# Altium schematic sheet 06_nRF_POWER_SWD_RF.SchDoc: SENSEI Base Board - nRF Power
size A3; DrawnBy: Sebastian Frey; Organization: Integrated Systems Laboratory; DocumentNumber: 7; Revision: v1.0; SheetNumber: 7; SheetTotal: 12
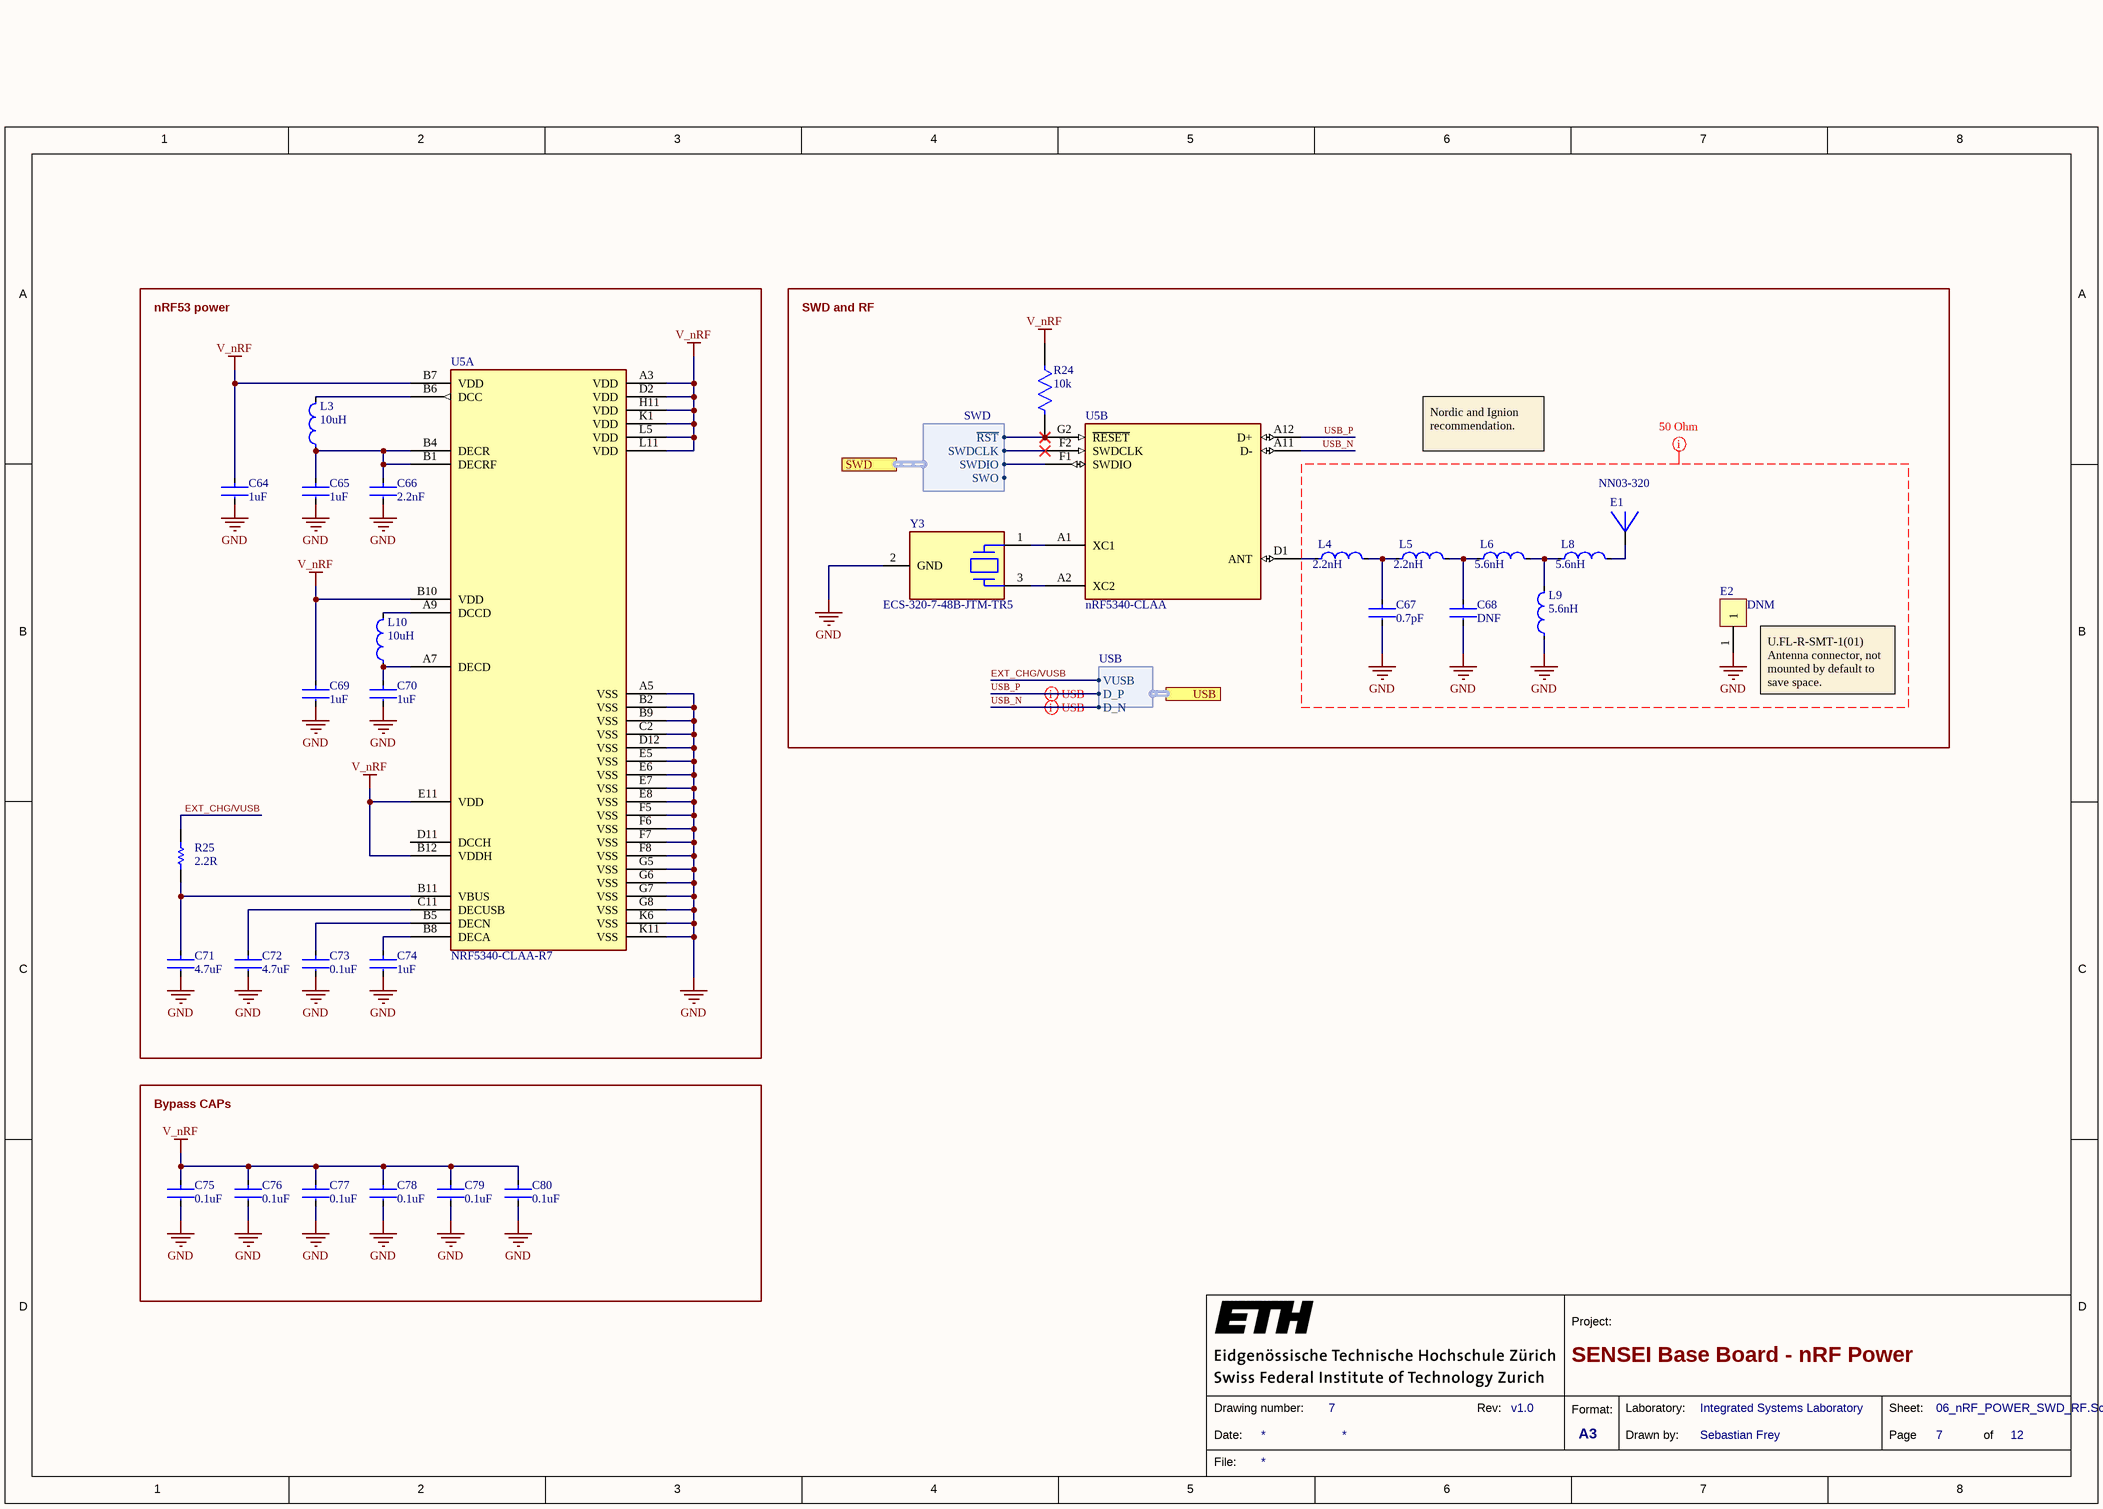
[diagram p0: 06_nRF_POWER_SWD_RF.SchDoc]

## Parts
C64  Capacitance: 1uF  [FP-CL03-IPC_B]  (hidden comment: CL03A105KP3NSNC)
C65  Capacitance: 1uF  [FP-CL03-IPC_B]  (hidden comment: CL03A105KP3NSNC)
C66  Capacitance: 2.2nF  [FP-GRM033-0_03-MFG]  (hidden comment: GRM033R71C222KA88D)
C67  Capacitance: 0.7pF  [FP-GJM033-0_03-IPC_C]  (hidden comment: GJM0335C1ER70BB01D)
C68  DNF  [FP-GRM033-0_03-MFG]
C69  Capacitance: 1uF  [FP-CL03-IPC_B]  (hidden comment: CL03A105KP3NSNC)
C70  Capacitance: 1uF  [FP-CL03-IPC_B]  (hidden comment: CL03A105KP3NSNC)
C71  Capacitance: 4.7uF  [FP-C1005-050-0_15-IPC_B]  (hidden comment: C1005X5R0J475K050BC)
C72  Capacitance: 4.7uF  [FP-C1005-050-0_15-IPC_B]  (hidden comment: C1005X5R0J475K050BC)
C73  Capacitance: 0.1uF  [FP-GRM033-0_03-IPC_B]  (hidden comment: GRM033Z71C104KE14D)
C74  Capacitance: 1uF  [FP-CL03-IPC_B]  (hidden comment: CL03A105KP3NSNC)
C75  Capacitance: 0.1uF  [FP-GRM033-0_03-IPC_B]  (hidden comment: GRM033Z71C104KE14D)
C76  Capacitance: 0.1uF  [FP-GRM033-0_03-IPC_B]  (hidden comment: GRM033Z71C104KE14D)
C77  Capacitance: 0.1uF  [FP-GRM033-0_03-IPC_B]  (hidden comment: GRM033Z71C104KE14D)
C78  Capacitance: 0.1uF  [FP-GRM033-0_03-IPC_B]  (hidden comment: GRM033Z71C104KE14D)
C79  Capacitance: 0.1uF  [FP-GRM033-0_03-IPC_B]  (hidden comment: GRM033Z71C104KE14D)
C80  Capacitance: 0.1uF  [FP-GRM033-0_03-IPC_B]  (hidden comment: GRM033Z71C104KE14D)
E1  NN03-320  [NN03-320]
E2  DNM  [U.FL-R-SMT-1(01)_GND_pad_small]
L3  Parameter 1: 10uH  [FP-LQM18DN_70-IPC_C]  (hidden comment: LQM18DN100M70L)
L4  Inductance: 2.2nH  [FP-LQP03HQ_02-MFG]  (hidden comment: LQP03HQ2N2B02D)
L5  Inductance: 2.2nH  [FP-LQP03HQ_02-MFG]  (hidden comment: LQP03HQ2N2B02D)
L6  Inductance: 5.6nH  [FP-LQW03AW_00-MFG]  (hidden comment: LQW03AW5N6J00D)
L8  Inductance: 5.6nH  [FP-LQW03AW_00-MFG]  (hidden comment: LQW03AW5N6J00D)
L9  Inductance: 5.6nH  [FP-LQW03AW_00-MFG]  (hidden comment: LQW03AW5N6J00D)
L10  Parameter 1: 10uH  [FP-LQM18DN_70-IPC_C]  (hidden comment: LQM18DN100M70L)
R24  Resistance: 10k  [FP-RMCF0201-IPC_C]  (hidden comment: RMCF0201FT10K0)
R25  value 2.2R  [RESC0201(0603)_L]  (hidden comment: RC0201FR-072R2L)
U5  NRF5340-CLAA-R7  [NRF5340_WLCSP]  (parts A,B of 3)
Y3  ECS-320-7-48B-JTM-TR5  [Y_ECX-1048]

## Blocks framed on the sheet
nRF53 power: C64-C66 C69-C74 L3 L10 R25 U5
SWD and RF: C67 C68 E1 E2 L4-L6 L8 L9 R24 U5 Y3
Bypass CAPs: C75-C80

## Ports
SWD (harness SWD), USB (harness USB)

## Harnesses
SWD: ~{RST}, SWDIO, SWDCLK, SWO
USB: VUSB, D_P, D_N

## Nets
GND: C64.2 C65.2 C66.2 C67.2 C68.2 C69.2 C70.2 C71.2 C72.2 C73.2 C74.2 C75.2 C76.2 C77.2 C78.2 C79.2 C80.2 E2.1 L9.1 U5.A5(VSS) U5.B2(VSS) U5.B9(VSS) U5.C2(VSS) U5.D12(VSS) U5.E5(VSS) U5.E6(VSS) U5.E7(VSS) U5.E8(VSS) U5.F5(VSS) U5.F6(VSS) U5.F7(VSS) U5.F8(VSS) U5.G5(VSS) U5.G6(VSS) U5.G7(VSS) U5.G8(VSS) U5.K6(VSS) U5.K11(VSS) Y3.2(GND)
V_nRF: C64.1 C69.1 C75.1 C76.1 C77.1 C78.1 C79.1 C80.1 R24.1 U5.A3(VDD) U5.B7(VDD) U5.B10(VDD) U5.B12(VDDH) U5.D2(VDD) U5.E11(VDD) U5.H11(VDD) U5.K1(VDD) U5.L5(VDD) U5.L11(VDD)
EXT_CHG/VUSB: R25.2 ; port USB.VUSB
USB_N: U5.A11(D-) ; port USB.D_N
USB_P: U5.A12(D+) ; port USB.D_P
NetC65_1: C65.1 C66.1 L3.1 U5.B1(DECRF) U5.B4(DECR)
NetC67_1: C67.1 L4.2 L5.1
NetC68_1: C68.1 L5.2 L6.1
NetC70_1: C70.1 L10.1 U5.A7(DECD)
NetC71_1: C71.1 R25.1 U5.B11(VBUS)
NetC72_1: C72.1 U5.C11(DECUSB)
NetC73_1: C73.1 U5.B5(DECN)
NetC74_1: C74.1 U5.B8(DECA)
NetE1_1: E1.1 L8.2
NetL3_2: L3.2 U5.B6(DCC)
NetL4_1: L4.1 U5.D1(ANT)
NetL6_2: L6.2 L8.1 L9.2
NetL10_2: L10.2 U5.A9(DCCD)
NetR24_2: R24.2 U5.G2(~{RESET}) ; port SWD.~{RST}
NetU5_A1: U5.A1(XC1) Y3.1
NetU5_A2: U5.A2(XC2) Y3.3
NetU5_F1: U5.F1(SWDIO) ; port SWD.SWDIO
NetU5_F2: U5.F2(SWDCLK) ; port SWD.SWDCLK

Not connected (* = marked no-connect by the designer): U5 D11(DCCH)

## Layout directives
net class 50OHM: GND
differential pair: USB_N, USB_P

## Notes on the sheet
- Nordic and Ignion recommendation.
- (near E2) U.FL-R-SMT-1(01)
  Antenna connector, not mounted by default to save space.
- 1
- 2
- 3
- 4
- 5
- 6
- 7
- 8
- A
- B
- C
- D
- Project:
- Date:
- Drawing number:
- Rev:
- Format:
- A3
- Drawn by:
- Laboratory:
- Page
- Sheet:
- of
- File:

## Library data of the parts
C64 C65 C69 C70 C74 = CMP-13271-003594-1: Cap Ceramic 1uF 10V X5R ±10% Pad SMD 0201 +85°C T/R; Min Operating Temperature: -55°C; Mount: Surface Mount; Packaging: Cut Tape; Width: 0.012inch; Tolerance: 10%; Case Code (Imperial): 0201; Thickness: 0.013inch; Length: 0.024inch; Case/Package: 0201; Max Operating Temperature: 85°C; Voltage Rating: 10V; Case Code (Metric): 0603
C66 = CMP-2010-01694-2: Chip Multilayer Ceramic Capacitors for General Purpose, 0201, 2200pF, X7R, 15%, 10%, 16V; Depth: 0.3mm; Package Quantity: 1; Min Operating Temperature: -55°C; Mount: Surface Mount; Case/Package: 0201; Packaging: Tape and Reel; Case Code (Imperial): 0201; Material: Ceramic; Voltage Rating: 16V; Termination: SMD/SMT; Tolerance: 10%; Case Code (Metric): 0603; Height: 0.3mm; Length: 0.6mm; Voltage Rating (DC): 16V; Width: 0.012inch; Thickness: 0.013inch; Radiation Hardening: No; REACH SVHC: No SVHC; Lead Free: Lead Free; Voltage: 16V; Max Operating Temperature: 125°C; Dielectric: X7R
C67 = CMP-2010-00919-2: Ceramic Capacitor 0.7pF ±0.1pF 25V C0G 0201 (0603 Metric); Width: 0.012inch; Case Code (Metric): 0603; Min Operating Temperature: -55°C; Lead Free: Lead Free; Dielectric: C0G; Packaging: Tape and Reel; Thickness: 0.013inch; Mount: Surface Mount; Radiation Hardening: No; Height: 0.3mm; Voltage Rating (DC): 25V; Case Code (Imperial): 0201; Case/Package: 0201; Package Quantity: 15000; Max Operating Temperature: 125°C; Voltage Rating: 25V; Termination: SMD/SMT; Length: 0.6mm; Depth: 0.3mm
C68 = CMP-06035-035508-1: Case/Package: 0201; Capacitance: DNF
C71 C72 = CMP-2000-05437-2: CAP CER 4.7UF 6.3V X5R 0402 10%; Dielectric Material: Ceramic; Voltage: 6.3V; Depth: 0.5mm; Tolerance: 10%; Height: 0.5mm; Length: 1mm; Termination: SMD/SMT; RoHS Compliant: Yes; Series: C; Case/Package: 0402; Dielectric: X5R; Lead Free: Lead Free; Mount: Surface Mount; Max Operating Temperature: 85°C; Min Operating Temperature: -55°C
C73 C75-C80 = CMP-06035-035508-1: Chip Multilayer Ceramic Capacitors for General Purpose, 0201, 0.10uF, X7R, 15%, 10%, 16V; Case/Package: 0201
E1 = NN03-320: Integrated Chip Antenna; Manufacturer: Fractus Antennas; Supplier 1: Mouser; Manufacturer Part Number: NN03-320; Supplier Part Number 1: 128-NN03-320
E2 = U.FL-R-SMT-1(01)_GND_pad
L3 L10 = CMP-06042-017052-1: Multilayer type Inductor for Power Lines 10uH ±20% @1MHz, 300mA, Max DCR 1.365Ω, SRF 32MHz
L4 L5 = CMP-06042-003257-1: Film type RF Inductor 2.2nH ±0.1nH 600mA 0.12Ω 0201 (0603); DC Resistance (DCR): 120mR; Shielding: Unshielded; Core Material: Non-Magnetic; Test Frequency: 500MHz; Self Resonant Frequency: 9GHz; Mount: Surface Mount; Case/Package: 0201; Resistor Type: Thin Film; Max Operating Temperature: 125°C; Packaging: Tape and Reel; Case Code (Imperial): 0201; Case Code (Metric): 0603; Min Operating Temperature: -55°C; Current Rating: 600mA
L6 L8 L9 = CMP-06042-008254-1: Wire Wound RF Inductor 5.6nH ±5% 330mA 0.33Ω 0201 (0603); DC Resistance (DCR): 330mR; Shielding: Unshielded; Core Material: Non-Magnetic; Self Resonant Frequency: 8.3GHz; Test Frequency: 100MHz; Q Factor: 47; Max DC Current: 330mA; Height: 0.4mm; Package Quantity: 10000; Current Rating: 330mA; Max Operating Temperature: 125°C; Packaging: Tape and Reel; Case/Package: Nonstandard; Length: 0.021inch; Mount: Surface Mount; Resistor Type: Wirewound; Tolerance: 5%; Min Operating Temperature: -55°C; Height - Seated (Max): 0.018inch; Termination: SMD/SMT; Width: 0.016inch
R24 = CMP-26527-002755-1: RES 10K OHM 1% 1/20W 0201; Max Power Dissipation: 50mW; Temperature Coefficient: 200ppm/°C; Length: 0.024inch; Min Operating Temperature: -55°C; Width: 0.012inch; Contact Plating: Tin; Case/Package: 0201; Power Rating: 50mW; Packaging: Tape and Reel; Resistor Type: Thick Film; Case Code (Metric): 0603; Tolerance: 1%; Case Code (Imperial): 0201; Max Operating Temperature: 125°C; Height: 0.009inch; Mount: Surface Mount; Series: RMCF; RoHS Compliant: Yes; Number of Terminations: 2
R25 = CMP-1010-00176-1: 2R2 0.05W 1% 0201 (0603 Metric)  SMD; Case-EIA: 0201; Case-Metric: 0603; Technology: SMT; Power: 0.05 W; Tolerance: 1 %
U5 = nRF5340-CLAA: Multi-protocol Bluetooth Low Energy, IEEE 802.15.4, ANT and 2.4GHz proprietary system-on-chip; Manufacturer: Nordic; Supplier 1: Mouser; Supplier Part Number 1: 949-NRF5340-CLAA-R7; Manufacturer Part Number: NRF5340-CLAA-R7
Y3 = Y_ECS-320-7-48B-JTM-TR5: Crystal 32MHz 7pF ±20ppm ±20ppm 4-Pin Ultraminiature CSMD T/R; Manufacturer: ECS International; Manufacturer Part Number: ECS-320-7-48B-JTM-TR5; Supplier 1: Mouser; Supplier Part Number 1: 520-ECS320748BJTMTR5